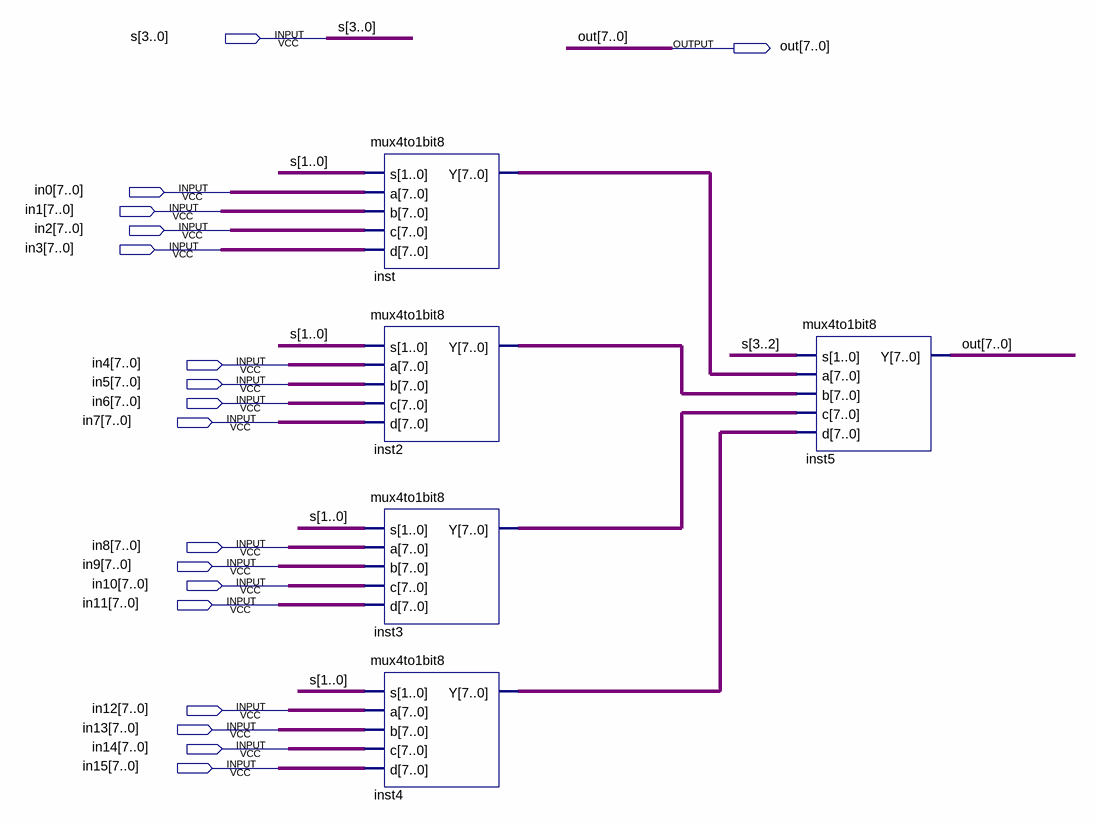
[diagram p0: schematic sheet]
// Quartus schematic mux16to1bit8.bdf as structural Verilog: 5 symbols, 18 pins
module mux16to1bit8 (
  input  [3:0] s,
  input  [7:0] in0,
  input  [7:0] in1,
  input  [7:0] in2,
  input  [7:0] in3,
  input  [7:0] in4,
  input  [7:0] in5,
  input  [7:0] in6,
  input  [7:0] in7,
  input  [7:0] in8,
  input  [7:0] in9,
  input  [7:0] in10,
  input  [7:0] in11,
  input  [7:0] in12,
  input  [7:0] in13,
  input  [7:0] in14,
  input  [7:0] in15,
  output [7:0] out
);

  wire [7:0] inst2_y, inst3_y, inst4_y, inst_y;

  mux4to1bit8 inst (.s(s[1:0]), .a(in0), .b(in1), .c(in2), .d(in3), .Y(inst_y));
  mux4to1bit8 inst2 (.s(s[1:0]), .a(in4), .b(in5), .c(in6), .d(in7), .Y(inst2_y));
  mux4to1bit8 inst3 (.s(s[1:0]), .a(in8), .b(in9), .c(in10), .d(in11), .Y(inst3_y));
  mux4to1bit8 inst4 (.s(s[1:0]), .a(in12), .b(in13), .c(in14), .d(in15), .Y(inst4_y));
  mux4to1bit8 inst5 (.s(s[3:2]), .a(inst_y), .b(inst2_y), .c(inst3_y), .d(inst4_y), .Y(out));
endmodule
